# EAGLE design pcb3 (EAGLE 9.6.0)
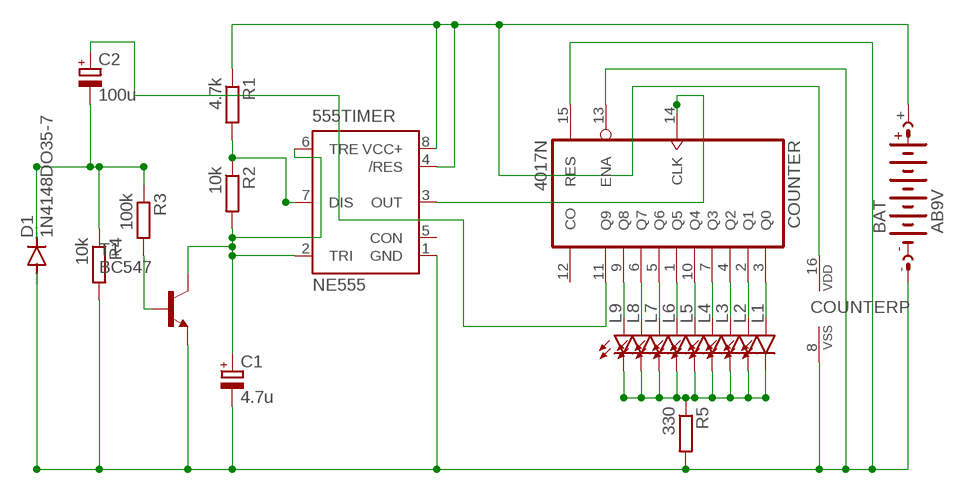
[diagram p0: schematic, sheet 1]

## Parts
555TIMER  NE555  [DIL-08]
BAT  AB9V  [AB9V]
C1  4.7u  CPOL-EUE2.5-5  [E2,5-5]
C2  100u  CPOL-EUE2.5-5  [E2,5-5]
COUNTER  4017N  [DIL16]
D1  1N4148DO35-7  [DO35-7]
L1  LED5MM  [LED5MM]
L2  LED5MM  [LED5MM]
L3  LED5MM  [LED5MM]
L4  LED5MM  [LED5MM]
L5  LED5MM  [LED5MM]
L6  LED5MM  [LED5MM]
L7  LED5MM  [LED5MM]
L8  LED5MM  [LED5MM]
L9  LED5MM  [LED5MM]
R1  4.7k  R-EU_0207/10  [0207/10]
R2  10k  R-EU_0207/10  [0207/10]
R3  100k  R-EU_0207/10  [0207/10]
R4  10k  R-EU_0207/10  [0207/10]
R5  330  R-EU_0207/10  [0207/10]
T1  BC547  [TO92]

## Nets
N$1: 555TIMER.7(DIS) R1.2 R2.1
N$2: 555TIMER.1(GND) BAT.- C1.- COUNTER.8(VSS) COUNTER.13(ENA) COUNTER.15(RES) D1.A R4.2 R5.2 T1.1(E)
N$3: R3.2 T1.2(B)
N$5: 555TIMER.2(TRI) 555TIMER.6(TRE) C1.+ R2.2 T1.3(C)
N$6: C2.+ COUNTER.11(Q9)
N$7: C2.- D1.C R3.1 R4.1
N$8: COUNTER.9(Q8) L9.A
N$9: COUNTER.6(Q7) L8.A
N$10: COUNTER.5(Q6) L7.A
N$11: COUNTER.1(Q5) L6.A
N$12: COUNTER.10(Q4) L5.A
N$13: COUNTER.7(Q3) L4.A
N$14: COUNTER.4(Q2) L3.A
N$15: COUNTER.2(Q1) L2.A
N$16: COUNTER.3(Q0) L1.A
N$17: L1.K(C) L2.K(C) L3.K(C) L4.K(C) L5.K(C) L6.K(C) L7.K(C) L8.K(C) L9.K(C) R5.1
N$18: 555TIMER.3(OUT) COUNTER.14(CLK)
N$21: 555TIMER.4(/RES) 555TIMER.8(VCC+) BAT.+ COUNTER.16(VDD) R1.1
Unconnected: 555TIMER.5(CON) COUNTER.12(CO)

## Library data of the parts
555TIMER = st-microelectronics:NE555: General purpose bipolar Timer; MF: Arrow Electronics; MPN: NE555N; OC_FARNELL: 1467742; OC_NEWARK: 89K1486
BAT = battery:AB9V: 9-V BATTERY CLIP
C1 C2 = rcl:CPOL-EU: POLARIZED CAPACITOR, European symbol; SPICEPREFIX: C
COUNTER = 40xx:4017: COUNTER/DIVIDER
D1 = diode:1N4148: DIODE high speed (Philips)
L1-L9 = led:LED: LED OSRAM: - CHIPLED LG R971, LG N971, LY N971, LG Q971, LY Q971, LO R971, LY R971 LH N974, LH R974 LS Q976, LO Q976, LY Q976 LO Q996 - Hyper CHIPLED LW Q18S LB Q993, LB Q99A, LB R99A - SideLED LS A670, LO A670, LY A670, LG A670, LP A670 LB A673, LV A673, LT A673, LW A673 LH A674 LY A675 LS A676, LA A676, LO A676, LY A676, LW A676 LS A679, LY A679, LG A679 - Hyper Micro SIDELED® LS Y876, LA Y876, LO Y876, LY Y876 LT Y87S - SmartLED LW L88C, LW L88S LB L89C, LB L89S, LG L890 LS L89K, LO L89K, LY L89K LS L896, LA L896, LO L896, LY L896 - TOPLED LS T670, LO T670, LY T670, LG T670, LP T670 LSG T670, LSP T670, LSY T670, LOP T670, LYG T670 LG T671, LOG T671, LSG T671 LB T673, LV T673, LT T673, LW T673 LH T674 LS T676, LA T676, LO T676, LY T676, LB T676, LH T676, LSB T676, LW T676 LB T67C, LV T67C, LT T67C, LS T67K, LO T67K, LY T67K, LW E67C LS E67B, LA E67B, LO E67B, LY E67B, LB E67C, LV E67C, LT E67C LW T67C LS T679, LY T679, LG T679 LS T770, LO T770, LY T770, LG T770, LP T770 LB T773, LV T773, LT T773, LW T773 LH T774 LS E675, LA E675, LY E675, LS T675 LS T776, LA T776, LO T776, LY T776, LB T776 LHGB T686 LT T68C, LB T68C - Hyper Mini TOPLED® LB M676 - Mini TOPLED Santana® LG M470 LS M47K, LO M47K, LY M47K Source: http://www.osram.convergy.de LUXEON: - LUMILED® LXK2-PW12-R00, LXK2-PW12-S00, LXK2-PW14-U00, LXK2-PW14-V00 LXK2-PM12-R00, LXK2-PM12-S00, LXK2-PM14-U00 LXK2-PE12-Q00, LXK2-PE12-R00, LXK2-PE12-S00, LXK2-PE14-T00, LXK2-PE14-U00 LXK2-PB12-K00, LXK2-PB12-L00, LXK2-PB12-M00, LXK2-PB14-N00, LXK2-PB14-P00, LXK2-PB14-Q00 LXK2-PR12-L00, LXK2-PR12-M00, LXK2-PR14-Q00, LXK2-PR14-R00 LXK2-PD12-Q00, LXK2-PD12-R00, LXK2-PD12-S00 LXK2-PH12-R00, LXK2-PH12-S00 LXK2-PL12-P00, LXK2-PL12-Q00, LXK2-PL12-R00 Source: www.luxeon.com KINGBRIGHT: KA-3528ASYC Source: www.kingbright.com
R1-R5 = rcl:R-EU_: RESISTOR, European symbol; SPICEPREFIX: R
T1 = transistor:BC547: NPN TRANSISTOR

## Board
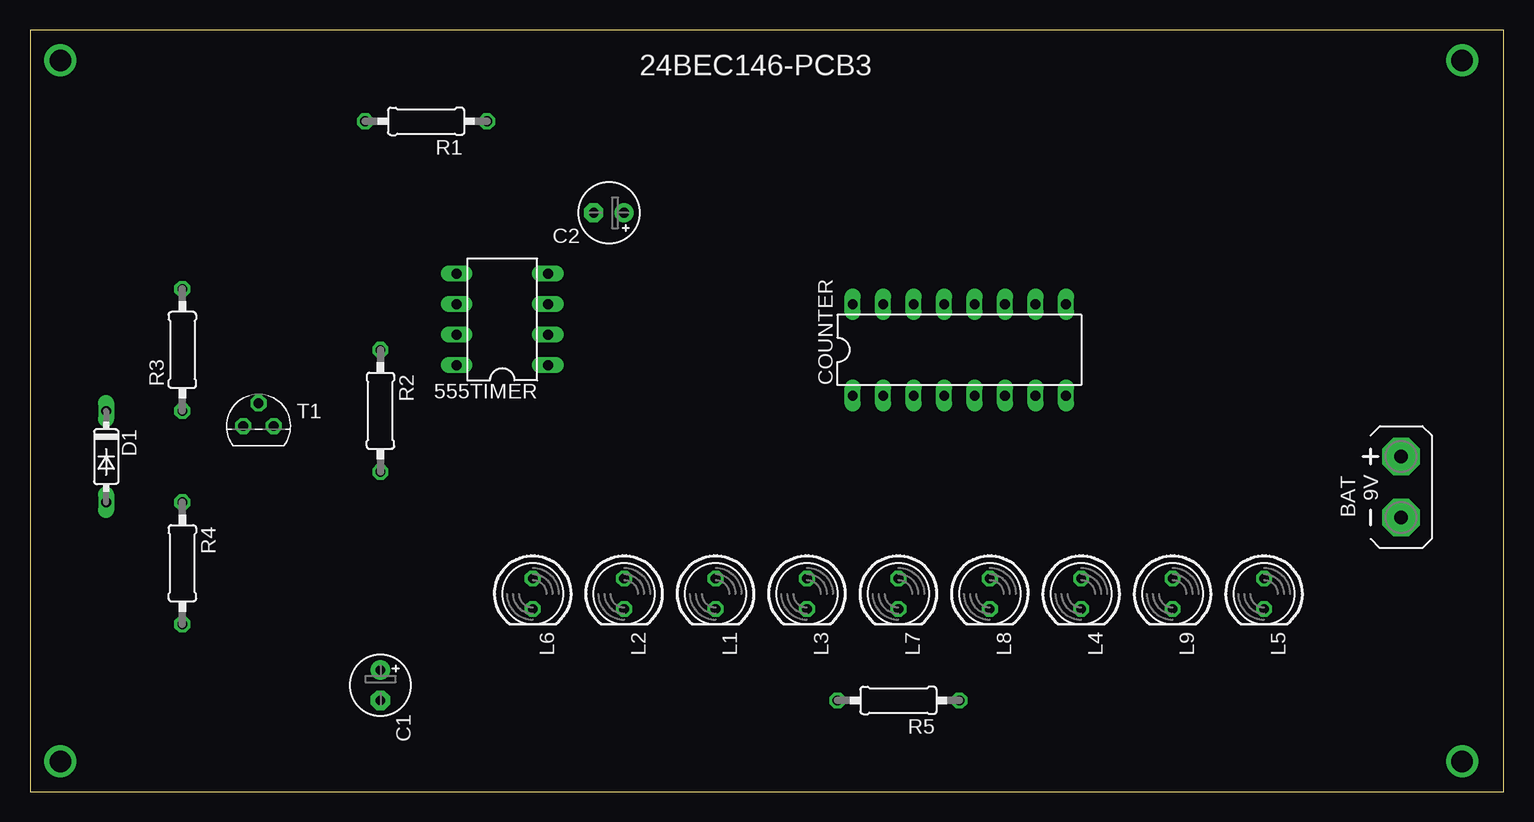
[diagram p1: board, top side]
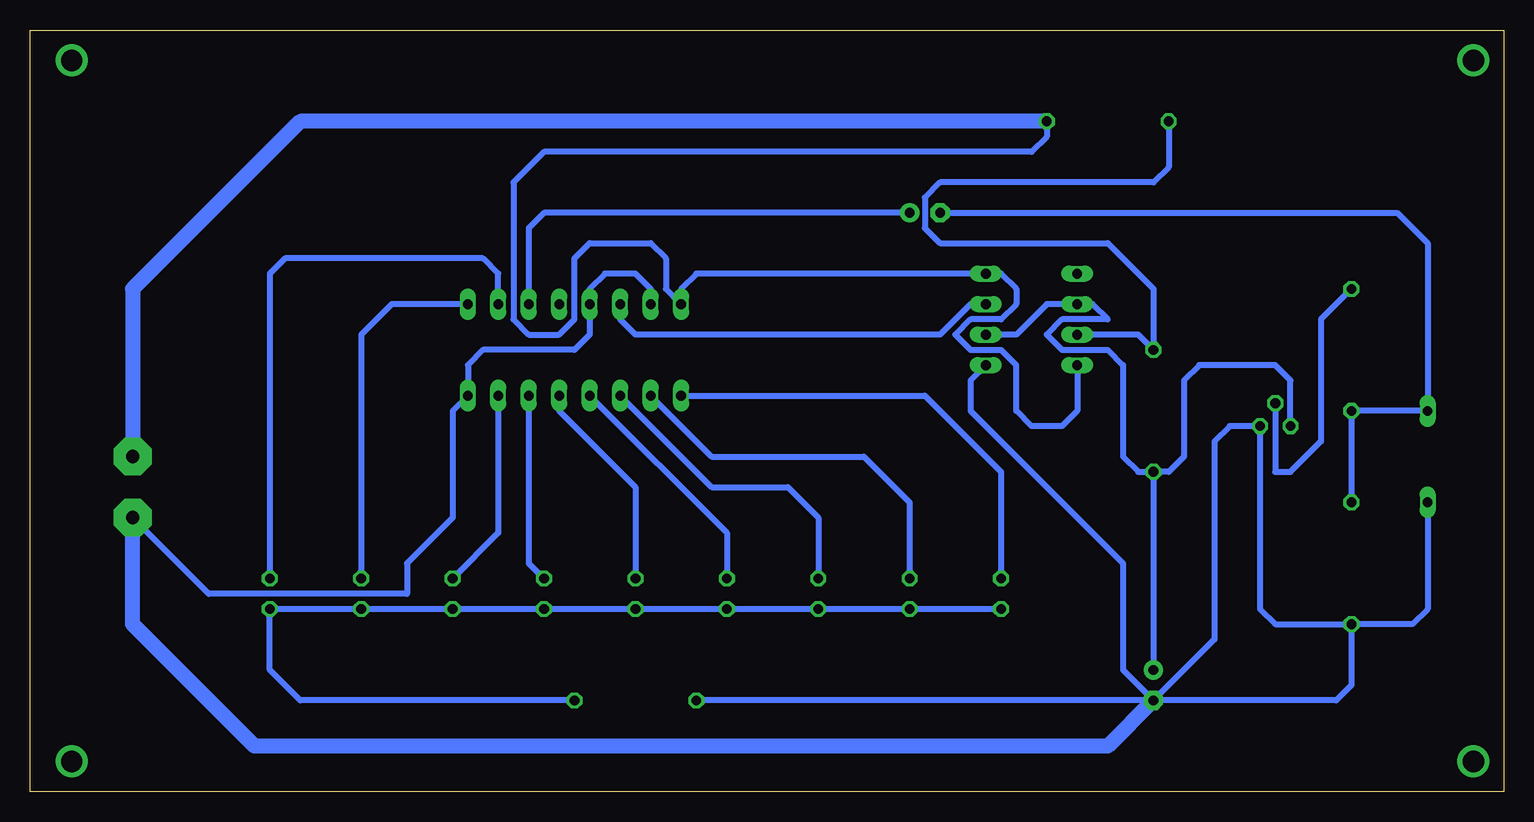
[diagram p2: board, bottom side, seen from below]

Size 122.86 x 63.49 mm. Coordinates in mm from the lower left corner, seen from the top.
Outline: 0,0 122.86,0 122.86,63.49 0,63.49 0,0
Copper layers (1*16): Top 0.035mm / dielectric 1.5mm / Bottom 0.035mm
Design rules "default": minimum track width 6mil, minimum drill 0.35mm, track to track 6mil, track to pad 6mil, pad to pad 6mil, via to via 6mil, smd to smd 6mil, copper to edge 40mil, drill to drill 6mil, minimum pad ring 10mil, minimum via ring 8mil, stop-mask expansion 4mil, vias tented up to drill 0mil, thermal gap 10mil

### Footprints (pad centres in the part's own frame; a part is rotated, then mirrored left to right if it is on the bottom)
DIL-08 = drill 0.813 long: 1 -3.81,-3.81; 2 -1.27,-3.81; 3 1.27,-3.81; 4 3.81,-3.81; 5 3.81,3.81; 6 1.27,3.81; 7 -1.27,3.81; 8 -3.81,3.81
AB9V = drill 1.118 pad 3.15 octagon: + 0,2.54; - 0,-2.54
E2,5-5 = drill 0.813 pad 1.6: + -1.27,0 | drill 0.813 pad 1.6 octagon: - 1.27,0
DIL16 = drill 0.813 long: 1 -8.89,-3.81; 2 -6.35,-3.81; 3 -3.81,-3.81; 4 -1.27,-3.81; 5 1.27,-3.81; 6 3.81,-3.81; 7 6.35,-3.81; 8 8.89,-3.81; 9 8.89,3.81; 10 6.35,3.81; 11 3.81,3.81; 12 1.27,3.81; 13 -1.27,3.81; 14 -3.81,3.81; 15 -6.35,3.81; 16 -8.89,3.81
DO35-7 = drill 0.813 long: A 3.81,0; C -3.81,0
LED5MM = drill 0.813 octagon: A -1.27,0; K 1.27,0
0207/10 = drill 0.813 octagon: 1 -5.08,0; 2 5.08,0
TO92 = drill 0.813 octagon: 1 1.27,0; 2 0,1.905; 3 -1.27,0

### Placement (x,y rotation side)
555TIMER  39.37,39.37 90 top
BAT  114.3,25.4 0 top
C1  29.21,8.89 270 top
C2  48.26,48.26 180 top
COUNTER  77.47,36.83 0 top
D1  6.35,27.94 270 top
L1  57.15,16.51 270 top
L2  49.53,16.51 270 top
L3  64.77,16.51 270 top
L4  87.63,16.51 270 top
L5  102.87,16.51 270 top
L6  41.91,16.51 270 top
L7  72.39,16.51 270 top
L8  80.01,16.51 270 top
L9  95.25,16.51 270 top
R1  33.02,55.88 180 top
R2  29.21,31.75 270 top
R3  12.7,36.83 90 top
R4  12.7,19.05 270 top
R5  72.39,7.62 180 top
T1  19.05,30.48 0 top

### Tracks (layer width: path | path; a pad name or v marks a point on that pad's centre or on a via)
N$1
  Bottom 0.508: 555TIMER.7 30.48,38.1 R2.1 29.21,41.91 33.02,45.72 46.99,45.72 48.26,46.99 48.26,49.53 46.99,50.8 29.21,50.8 27.94,52.07 R1.2
N$2
  Bottom 0.508: C1.- R5.2 | R4.2 19.05,13.97 20.32,15.24 T1.1 22.86,30.48 24.13,29.21 24.13,12.7 C1.- | D1.A 6.35,15.24 7.62,13.97 R4.2 | R4.2 12.7,8.89 13.97,7.62 C1.- | BAT.- 107.95,16.51 91.44,16.51 91.44,19.05 87.63,22.86 87.63,31.75 COUNTER.8 86.36,35.56 85.09,36.83 77.47,36.83 76.2,38.1 COUNTER.13 76.2,41.91 74.93,43.18 72.39,43.18 71.12,41.91 COUNTER.15 | 555TIMER.1 44.45,34.29 44.45,31.75 31.75,19.05 31.75,10.16 C1.-
  Bottom 1.27: C1.- 33.02,3.81 104.14,3.81 114.3,13.97 BAT.-
N$3
  Bottom 0.508: R3.2 15.24,39.37 15.24,29.21 17.78,26.67 19.05,26.67 T1.2
N$4  (via drill 1.78)
  other vias: 2.54,60.96
N$5
  Bottom 0.508: R2.2 C1.+ | R2.2 30.48,26.67 31.75,27.94 31.75,35.56 33.02,36.83 36.83,36.83 38.1,38.1 36.83,39.37 33.02,39.37 34.29,40.64 555TIMER.6 38.1,40.64 40.64,38.1 555TIMER.2 | T1.3 17.78,34.29 19.05,35.56 25.4,35.56 26.67,34.29 26.67,27.94 27.94,26.67 R2.2
N$6
  Bottom 0.508: C2.+ 80.01,48.26 81.28,46.99 COUNTER.11
N$7
  Bottom 0.508: R4.1 R3.1 D1.C 6.35,45.72 8.89,48.26 C2.-
N$8
  Bottom 0.508: COUNTER.9 92.71,40.64 95.25,38.1 L9.A
N$9
  Bottom 0.508: COUNTER.6 81.28,19.05 L8.A
N$10
  Bottom 0.508: COUNTER.5 78.74,31.75 72.39,25.4 L7.A
N$11
  Bottom 0.508: COUNTER.1 48.26,33.02 41.91,26.67 L6.A
N$12
  Bottom 0.508: COUNTER.10 83.82,43.18 85.09,44.45 101.6,44.45 102.87,43.18 L5.A
N$13
  Bottom 0.508: COUNTER.7 83.82,21.59 L4.A
N$14
  Bottom 0.508: COUNTER.4 64.77,21.59 L3.A
N$15
  Bottom 0.508: COUNTER.2 66.04,27.94 53.34,27.94 49.53,24.13 L2.A
N$16
  Bottom 0.508: COUNTER.3 66.04,25.4 59.69,25.4 57.15,22.86 L1.A
N$17
  Bottom 0.508: L6.K L2.K L1.K L3.K L7.K L8.K L4.K L9.K L5.K 102.87,10.16 100.33,7.62 R5.1
N$18
  Bottom 0.508: 555TIMER.3 44.45,40.64 46.99,38.1 72.39,38.1 73.66,39.37 COUNTER.14
N$19  (via drill 1.78)
  other vias: 2.54,2.54
N$20  (via drill 1.78)
  other vias: 119.38,60.96
N$21
  Bottom 0.508: 555TIMER.8 35.56,31.75 36.83,30.48 39.37,30.48 40.64,31.75 40.64,35.56 41.91,36.83 44.45,36.83 45.72,38.1 44.45,39.37 41.91,39.37 40.64,40.64 40.64,41.91 41.91,43.18 555TIMER.4 67.31,43.18 68.58,41.91 COUNTER.16 69.85,41.91 69.85,44.45 71.12,45.72 76.2,45.72 77.47,44.45 77.47,39.37 78.74,38.1 81.28,38.1 82.55,39.37 82.55,50.8 80.01,53.34 39.37,53.34 38.1,54.61 R1.1
  Bottom 1.27: R1.1 100.33,55.88 114.3,41.91 BAT.+
N$22  (via drill 1.78)
  other vias: 119.38,2.54

### Text on the board
tPlace: 24BEC146-PCB3